# Altium schematic sheet CAN_Sheet.SchDoc
size 420 x 297 mm; SheetNumber: 4; SheetTotal: 10
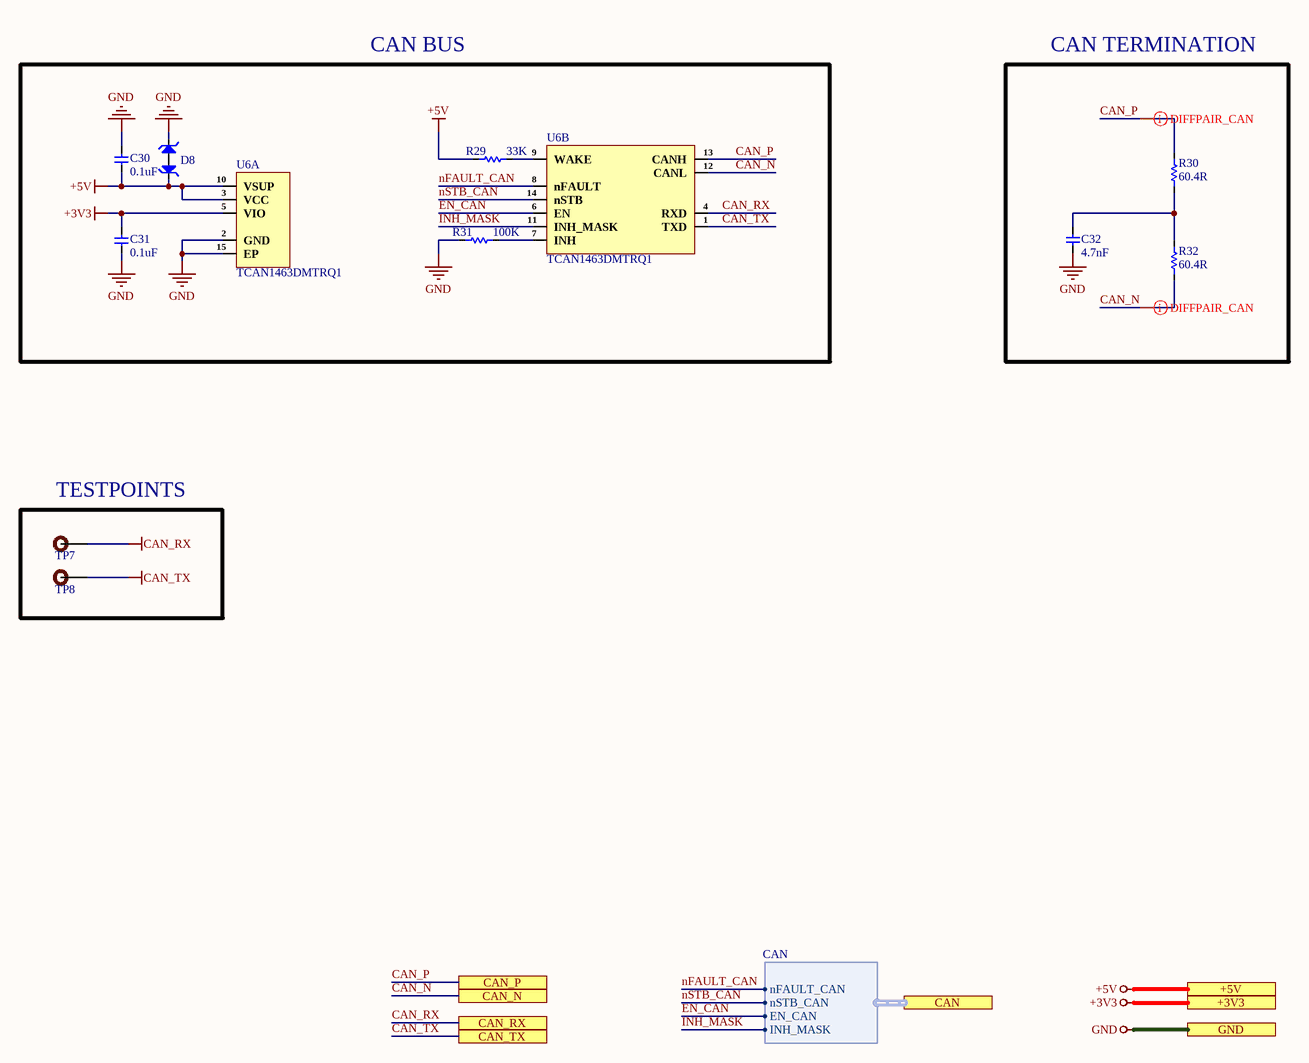
[diagram p0: CAN_Sheet.SchDoc]

## Parts
C30  0.1uF  [Cap-0402]
C31  0.1uF  [Cap-0402]
C32  4.7nF  [Cap-0402]
D8  PESD5V0H1BSFYL  [DSN0603-2]  (value not drawn)
R29  33K  [Res-0402]
R30  60.4R  [Res-0603]
R31  100K  [Res-0402]
R32  60.4R  [Res-0603]
TP7  TEST POINT  [Test-point]  (value not drawn)  (no BOM)
TP8  TEST POINT  [Test-point]  (value not drawn)  (no BOM)
U6  TCAN1463DMTRQ1  [VSON-14(3x4.5)]  (parts A,B of 2)

## Ports
+3V3 (see Top_Sheet[5C], Controller_Sheet[5D], EtherCAT_Sheet[5D], Power_Sheet[5D], RJ45_Sheet[5D], RS485_RS232_Sheet[5D]), +5V (see Top_Sheet[5B], Power_Sheet[5D]), CAN (harness CAN, see Top_Sheet[5C], Controller_Sheet[3D]), CAN_N (see Top_Sheet[5C], Connector_Sheet[3D]), CAN_P (see Top_Sheet[5C], Connector_Sheet[3D]), CAN_RX (see Top_Sheet[5C], Controller_Sheet[2D]), CAN_TX (see Top_Sheet[5C], Controller_Sheet[2D]), GND (see Top_Sheet[5C], Connector_Sheet[5D], Controller_Sheet[5D], EtherCAT_Sheet[5D], Power_Sheet[5D], Relay_Sheet[5D], RJ45_Sheet[5D], RS485_RS232_Sheet[5D])

## Harnesses
CAN: nFAULT_CAN, nSTB_CAN, EN_CAN, INH_MASK

## Nets
+3V3: C31.2 U6.5(VIO) ; port +3V3
+5V: C30.1 D8.1 R29.1 U6.3(VCC) U6.10(VSUP) ; port +5V
CAN_RX: TP7.1 U6.4(RXD) ; port CAN_RX
CAN_TX: TP8.1 U6.1(TXD) ; port CAN_TX
GND: C30.2 C31.1 C32.2 D8.2 R31.1 U6.2(GND) U6.15(EP) ; port GND
CAN_N: R32.2 U6.12(CANL) ; port CAN_N
CAN_P: R30.1 U6.13(CANH) ; port CAN_P
EN_CAN: U6.6(EN) ; port CAN.EN_CAN
INH_MASK: U6.11(INH_MASK) ; port CAN.INH_MASK
nFAULT_CAN: U6.8(nFAULT) ; port CAN.nFAULT_CAN
nSTB_CAN: U6.14(nSTB) ; port CAN.nSTB_CAN
NetC32_1: C32.1 R30.2 R32.1
NetR29_2: R29.2 U6.9(WAKE)
NetR31_2: R31.2 U6.7(INH)

## Layout directives
differential pair; net class CAN; differential pair class CAN_Lines: CAN_N, CAN_P

## Notes on the sheet
- CAN BUS
- CAN TERMINATION
- (near TP7) TESTPOINTS
- File:
- Title:
- Date:
- Page
- Num:
- Total:
- Drawn By: Huzaifa Ali

## Library data of the parts
C30 C31 = CC0402JRX7R7BB104: CAP CER 0.1UF 16V X7R 0402; Manufacturer: Yageo; Material: 4241ConductorMaterial; Value: 100nF; Tolerance: 5%; Item Type: Capacitor; Supplier: Digikey; Supplier Part Number: 311-1676-1-ND; Manufacturer Part Number: CC0402JRX7R7BB104; RoHS: Yes; Category: Ceramic Capacitors; Stock: 1659111; Pricing: 1=0.1, 10=0.046, 50=0.0262, 100=0.0203, 500=0.01528, 1000=0.012, 2500=0.01091, 5000=0.01004 (USD); Mounting Technology: Surface Mount; Case/Package: 0402; Case Code (Metric): 1005; Case Code (Imperial): 0402; Min Operating Temperature: -55°C; Max Operating Temperature: 125°C; Dielectric: X7R; Packaging: Tape and Reel; Package Quantity: 10000; Voltage Rating (DC): 16V; Voltage Rating: 16V; Series: CC; Construction: Flat; Length: 0.039inch; Width: 0.02inch; Height: 0.5mm; Thickness: 0.022inch; Lead Free: Lead Free; Halogen Free: Halogen Free; RoHS Compliant: Yes; ComponentLink1URL: https://datasheet.ciiva.com/13210/upy-gphc-x7r-6-3v-to-50v-8-12304-13210152.pdf?src-supplier=Mouser; ComponentLink1Description: https://datasheet.ciiva.com/13210/upy-gphc-x7r-6-3v-to-50v-8-12304-13210152.pdf?src-supplier=Mouser; LCSC Part Number: C541464
C32 = CC0402KRX7R9BB472: CAP CER 4700PF 50V X7R 0402; Manufacturer: Yageo; Material: 4241ConductorMaterial; Tolerance: 10%; Temperature Coefficient: 30ppm/°C; Item Type: Capacitor; Supplier 1: Future Electronics; Manufacturer Part Number: CC0402KRX7R9BB472; RoHS: Yes; Category: Ceramic Capacitors; Stock 1: 1780000; Pricing 1: 10000=0.0021, 40000=0.002, 150000=0.0019, 400000=0.0018, 1000000=0.0017 (USD); Mount: Surface Mount; Case/Package: 0402; Number of Pins: 2NUMBER; Case Code (Imperial): 0402; Case Code (Metric): 1005; Min Operating Temperature: -55°C; Max Operating Temperature: 125°C; Capacitance: 4.7nF; Dielectric: X7R; Voltage Rating: 50V; Voltage Rating (DC): 50V; Packaging: Tape and Reel; Package Quantity: 1; Termination: SMD/SMT; Series: CC; Construction: Flat; Length: 1mm; Width: 0.02inch; Height: 0.5mm; Thickness: 0.022inch; Depth: 0.5mm; Radiation Hardening: No; Reach SVHC Compliant: No; RoHS Compliant: Yes; Halogen Free: 5694HalogenFree; Lead Free: 5697LeadFree; ComponentLink1URL: https://datasheet.ciiva.com/7978/1489800-7978108.pdf?src-supplier=Element14; ComponentLink1Description: https://datasheet.ciiva.com/7978/1489800-7978108.pdf?src-supplier=Element14; ComponentLink2URL: https://datasheet.ciiva.com/176/mlccorderingcode-176364.pdf?src-supplier=Digikey; ComponentLink2Description: https://datasheet.ciiva.com/176/mlccorderingcode-176364.pdf?src-supplier=Digikey; ComponentLink3URL: https://datasheet.ciiva.com/176/mlccorderingcode-176363.pdf?src-supplier=Digikey; ComponentLink3Description: https://datasheet.ciiva.com/176/mlccorderingcode-176363.pdf?src-supplier=Digikey; ComponentLink4URL: https://datasheet.ciiva.com/176/mlccorderingcode-176365.pdf?src-supplier=Digikey; ComponentLink4Description: https://datasheet.ciiva.com/176/mlccorderingcode-176365.pdf?src-supplier=Digikey; ComponentLink5URL: https://datasheet.ciiva.com/11586/upy-gphc-x7r-6-3v-to-50v-8-11586491.pdf?src-supplier=Avnet; ComponentLink5Description: https://datasheet.ciiva.com/11586/upy-gphc-x7r-6-3v-to-50v-8-11586491.pdf?src-supplier=Avnet; Supplier Part Number 1: 1989300
D8 = PESD5V0H1BSFYL: TVS DIODE 5VWM 6.3VC DSN0603-2; Manufacturer: Nexperia; Supplier 1: Avnet; Manufacturer Part Number: PESD5V0H1BSFYL; RoHS: Yes; Category: ESD and Circuit Protection ICs; Stock 1: 9000; Pricing 1: 18000=0.06453, 36000=0.06278, 54000=0.06104, 90000=0.05930, 180000=0.05755, 900000=0.05581, 1800000=0.05406 (USD); RoHS Compliant: Yes; ComponentLink1URL: http://www.farnell.com/datasheets/1961312.pdf?src-supplier=Farnell; ComponentLink1Description: http://www.farnell.com/datasheets/1961312.pdf?src-supplier=Farnell; ComponentLink2URL: https://assets.nexperia.com/documents/data-sheet/PESD5V0H1BSF.pdf?src-supplier=Digi-Key; ComponentLink2Description: https://assets.nexperia.com/documents/data-sheet/PESD5V0H1BSF.pdf?src-supplier=Digi-Key; ComponentLink3URL: http://www.farnell.com/datasheets/1961312.pdf?src-supplier=Newark; ComponentLink3Description: http://www.farnell.com/datasheets/1961312.pdf?src-supplier=Newark; Supplier Part Number 1: PESD5V0H1BSFYL; LCSC Part Number: C477989; Item Type: Diode
R29 = RC0402FR-0733KL: RES 33K OHM 1% 1/16W 0402; Manufacturer: YAGEO; Item Type: Resistor; Manufacturer Part Number: RC0402FR-0733KL; Package: 0402; LCSC Part Number: C138003; ComponentLink1Description: LCSC; ComponentLink1URL: https://www.lcsc.com/product-detail/Chip-Resistor-Surface-Mount_YAGEO-RC0402FR-0733KL_C138003.html
R30 R32 = RTT0360R4FTP: 100mW Thick Film Resistors ±100ppm/℃ ±1% 60.4Ω 0603 Chip Resistor - Surface Mount ROHS; Manuacturer: RALEC; Manufacturer Part Number: RTT0360R4FTP; Package: 0603; Value: 60.4R; LCSC Part Number: C103744; ComponentLink1Description: LCSC; ComponentLink1URL: https://www.lcsc.com/product-detail/Chip-Resistor-Surface-Mount_RALEC-RTT0360R4FTP_C103744.html
R31 = RC0402FR-07100KL: RES 100K OHM 1% 1/16W 0402; Manufacturer: Yageo; Resistance: 100kR; Temperature Coefficient: 100ppm/°C; Power Rating: 63mW; Voltage Rating: 50V; Item Type: Resistor; Supplier 1: Mouser; Manufacturer Part Number: RC0402FR-07100KL; RoHS: Yes; Category: Chip SMD Resistors; Stock 1: 7759549; Pricing 1: 1=0.10000, 10=0.01200, 50=0.01200, 100=0.00500, 1000=0.00300, 2500=0.00200, 10000=0.00100 (USD); Case/Package: 0402; Case Code (Metric): 1005; Case Code (Imperial): 0402; Min Operating Temperature: -55°C; Max Operating Temperature: 155°C; Resistor Type: Thick Film; Tolerance: 1%; Packaging: Tape and Reel; Package Quantity: 1; Number of Terminations: 2; Termination: SMD/SMT; Max Power Dissipation: 63mW; Working Voltage: 50V; Features: Moisture Resistant; Series: RC; Resistance Tolerance: 1%; Construction: Rectangular; Technology: THICK FILM; Length: 0.039inch; Width: 0.02inch; Height: 0.016inch; Depth: 0.5mm; REACH SVHC: No SVHC; Lead Free: Lead Free; RoHS Compliant: Yes; Military Standard: Not; ComponentLink1URL: https://datasheet.ciiva.com/11819/0900766b80c66297-11819452.pdf?src-supplier=RSComponents; ComponentLink1Description: https://datasheet.ciiva.com/11819/0900766b80c66297-11819452.pdf?src-supplier=RSComponents; ComponentLink2URL: https://datasheet.ciiva.com/22747/1018594-22747509.pdf?src-supplier=Element14; ComponentLink2Description: https://datasheet.ciiva.com/22747/1018594-22747509.pdf?src-supplier=Element14; ComponentLink3URL: https://datasheet.ciiva.com/2453/pyu-r-int-thick-7-2453362.pdf?src-supplier=Digi-Key; ComponentLink3Description: https://datasheet.ciiva.com/2453/pyu-r-int-thick-7-2453362.pdf?src-supplier=Digi-Key; ComponentLink4URL: https://datasheet.ciiva.com/2453/pyu-r-int-thick-7-2453363.pdf?src-supplier=Digi-Key; ComponentLink4Description: https://datasheet.ciiva.com/2453/pyu-r-int-thick-7-2453363.pdf?src-supplier=Digi-Key; ComponentLink5URL: https://datasheet.ciiva.com/2453/pyu-r-int-thick-7-2453361.pdf?src-supplier=Digi-Key; ComponentLink5Description: https://datasheet.ciiva.com/2453/pyu-r-int-thick-7-2453361.pdf?src-supplier=Digi-Key; ComponentLink6URL: https://datasheet.ciiva.com/12667/pyu-rc0402-51-rohs-l-6-r-12667930.pdf?src-supplier=Mouser; ComponentLink6Description: https://datasheet.ciiva.com/12667/pyu-rc0402-51-rohs-l-6-r-12667930.pdf?src-supplier=Mouser; ComponentLink7URL: https://datasheet.ciiva.com/15189/getdatasheetpartid-323696-15189334.pdf?src-supplier=Verical; ComponentLink7Description: https://datasheet.ciiva.com/15189/getdatasheetpartid-323696-15189334.pdf?src-supplier=Verical; Supplier Part Number 1: 603-RC0402FR-07100KL; LCSC Part Number: C60491
TP7 TP8 = TEST POINT: Test Point ON; Item Type: TEST POINT
U6 = TCAN1463DMTRQ1: IC TRANSCEIVER HALF 1/1 14VSON; Manufacturer: Texas Instruments; Supplier: Mouser; Supplier Part Number: 595-TCAN1463DMTRQ1; Manufacturer Part Number: TCAN1463DMTRQ1; RoHS: Yes; Item Type: IC; Stock: 20610; Pricing: 1=2.47, 10=2.22, 50=2.22, 100=1.78, 1000=1.21, 10000=1.09 (USD); LCSC Part Number: C5215823